# EAGLE design TeensyBreakout (EAGLE 9.5.2)

## Sheet 1 of 2
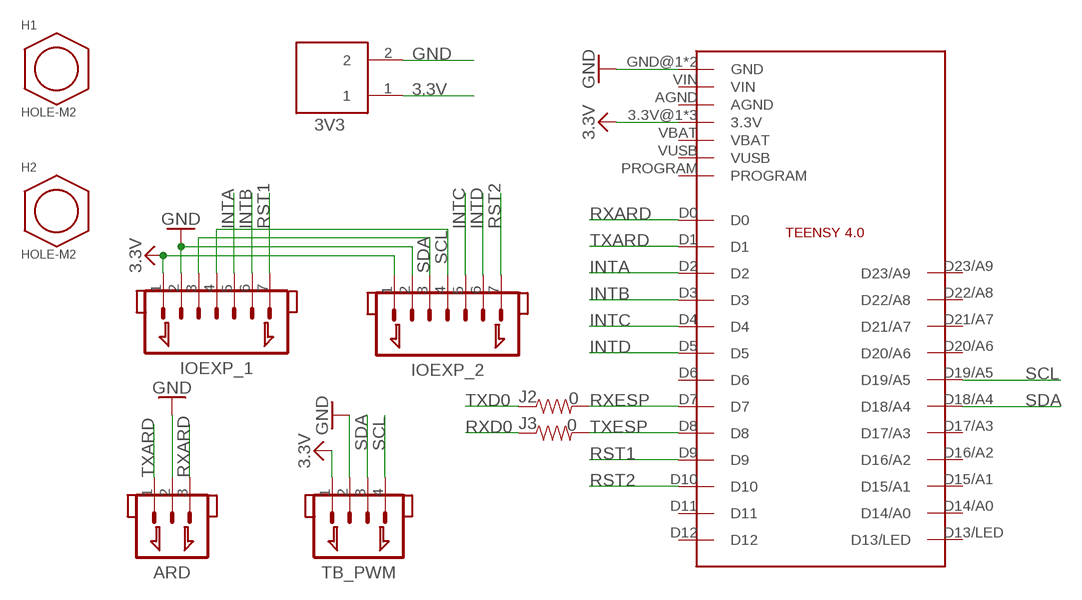
[diagram p0: schematic, sheet 1]

### Parts
3V3  TERMINAL  [ED555/2DS]
ARD  JST_1.25_3P  [JST1.25_3P]
H1  HOLE-M2  [M2]
H2  HOLE-M2  [M2]
IOEXP_1  JST_1.25_7P  [JST1.25_7P]
IOEXP_2  JST_1.25_7P  [JST1.25_7P]
J2  0  RESISTOR0603  [0603]
J3  0  RESISTOR0603  [0603]
TB_PWM  JST_1.25_4P  [JST1.25_4P]
U$1  TEENSY4.0  [TEENSY4.0]

### Nets
3.3V: 3V3.1 IOEXP_1.1 IOEXP_2.1 TB_PWM.1 U$1.3.3V@1(3.3V) U$1.3.3V@2(3.3V) U$1.ON/OFF(3.3V) ; supply symbol labelled SUPPLY_3.3V ; also sheet 2
GND: 3V3.2 ARD.2 IOEXP_1.2 IOEXP_2.2 TB_PWM.2 U$1.GND@1(GND) U$1.GND@2(GND) ; supply symbol labelled SUPPLY_GND ; also sheet 2
INTA: IOEXP_1.5 U$1.D2
INTB: IOEXP_1.6 U$1.D3
INTC: IOEXP_2.5 U$1.D4
INTD: IOEXP_2.6 U$1.D5
RST1: IOEXP_1.7 U$1.D9
RST2: IOEXP_2.7 U$1.D10
RXARD: ARD.3 U$1.D0
RXD0: J3.1 ; also sheet 2
RXESP: J2.2 U$1.D7
SCL: IOEXP_1.4 IOEXP_2.4 TB_PWM.4 U$1.D19/A5
SDA: IOEXP_1.3 IOEXP_2.3 TB_PWM.3 U$1.D18/A4
TXARD: ARD.1 U$1.D1
TXD0: J2.1 ; also sheet 2
TXESP: J3.2 U$1.D8
Unconnected: U$1.AGND U$1.D6 U$1.D11 U$1.D12 U$1.D13/LED U$1.D14/A0 U$1.D15/A1 U$1.D16/A2 U$1.D17/A3 U$1.D20/A6 U$1.D21/A7 U$1.D22/A8 U$1.D23/A9 U$1.PROGRAM U$1.VBAT U$1.VIN U$1.VUSB

## Sheet 2 of 2
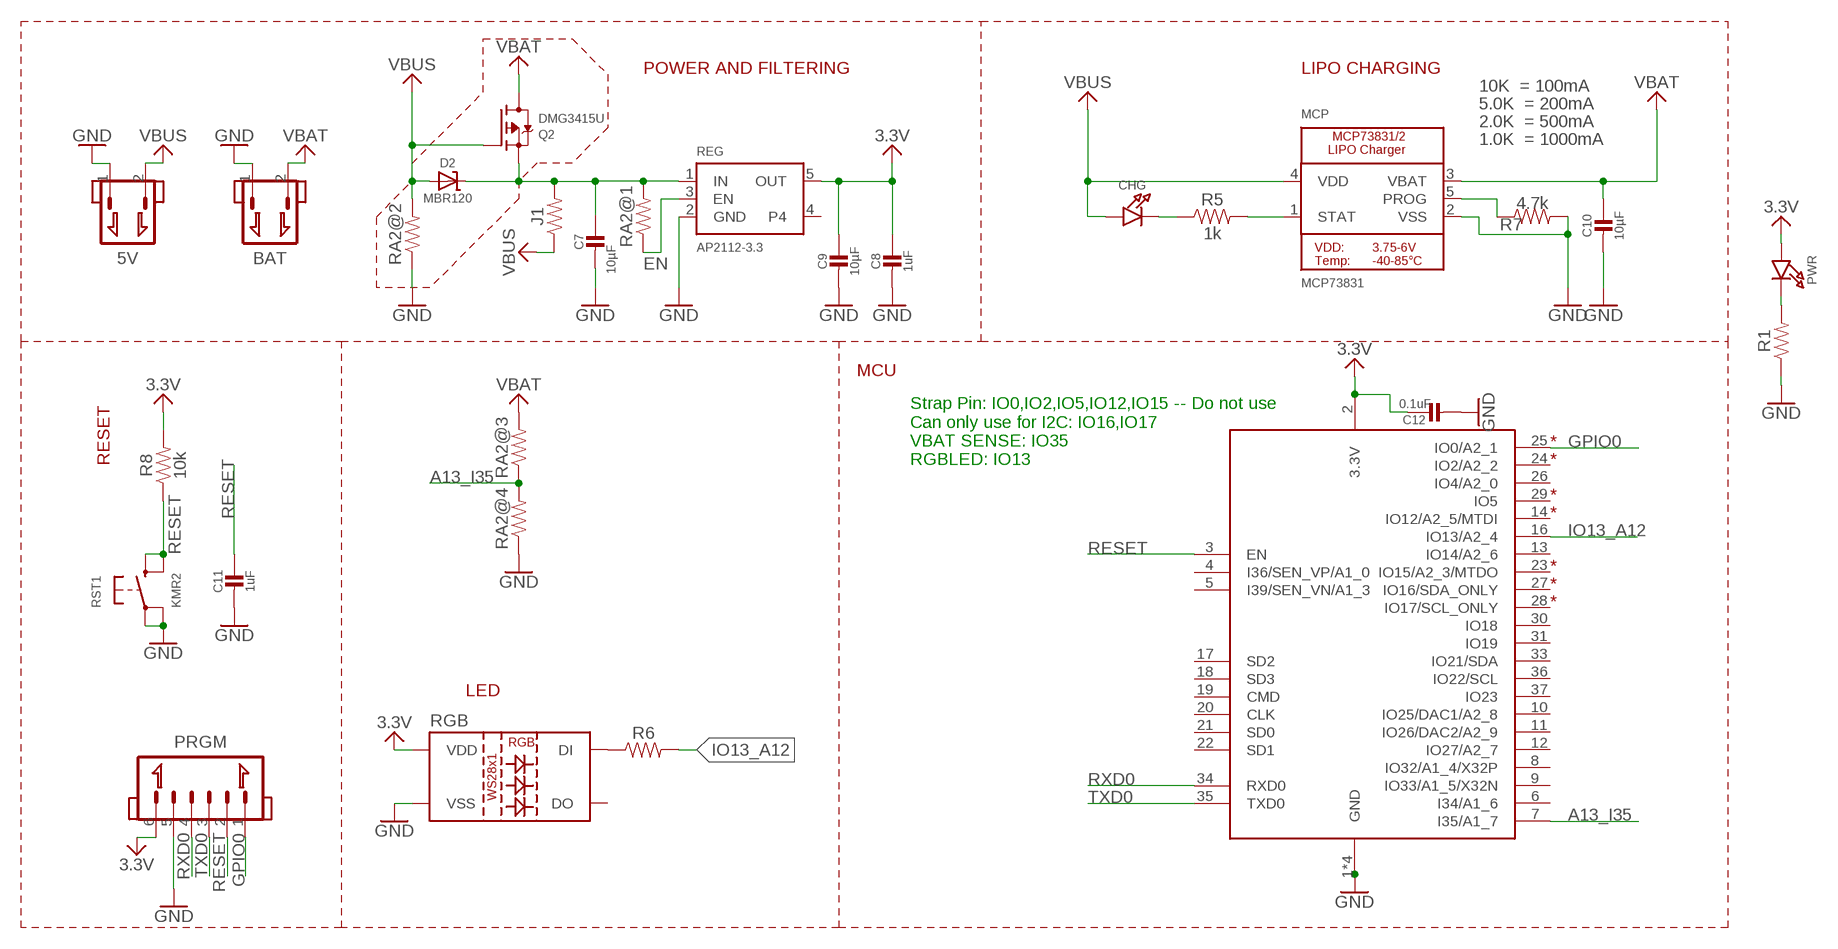
[diagram p1: schematic, sheet 2]

### Parts
5V  JST_PH_2.0_2P  [JST_PH_2.0_2P]
BAT  JSTPH  JST_PH_2.0_2P  [JST_PH_2.0_2P]
C7  10µF  CAP_CERAMIC_0805  [0805]
C8  1uF  CAP_CERAMIC_0603  [0603]
C9  10µF  CAP_CERAMIC_0603  [0603]
C10  10µF  CAP_CERAMIC_0805  [0805]
C11  1uF  CAP_CERAMIC_0603  [0603]
C12  0.1uF  CAP_CERAMIC_0603  [0603]
CHG  LED0603  [CHIPLED_0603]
D2  MBR120  DIODE-SCHOTTKYSOD-123  [SOD-123]
J1  RESISTOR0603  [0603]
MCP  MCP73831  MCP73831/2  [MICROBUILDER_SOT23-5]
PRGM  JST_1.25_6P  [JST1.25_6P]
PWR  LED0603  [CHIPLED_0603]
Q2  DMG3415U  MOSFET-PWIDE  [SOT23-WIDE]
R1  RESISTOR0603  [0603]
R5  1k  RESISTOR0603  [0603]
R6  RESISTOR0603  [0603]
R7  4.7k  RESISTOR0603  [0603]
R8  10k  RESISTOR0603  [0603]
RA2  RESISTOR_ARRAY_1206_SEPARATE_REVERSE  [RESCAF80P320X160X60-8N]
REG  AP2112-3.3  VREG_SOT23-5  [MICROBUILDER_SOT23-5]
RGB  LED_WS2812  [LED-TRICOLOR-5050-IC]
RST1  KMR2  SWITCH_TACT_SMT4.6X2.8  [BTN_KMR2_4.6X2.8]
X1  ESP32_WROOM32  [WROOM32]

### Nets
3.3V: C8.1 C9.1 C12.1 PRGM.6 PWR.A R8.2 REG.5(OUT) RGB.VDD X1.2(3.3V) ; supply symbol labelled SUPPLY_3.3V ; also sheet 1
A13_I35: RA2.4 RA2.6 X1.7(I35/A1_7)
EN: RA2.8 REG.3(EN)
GND: 5V.1 BAT.1 C7.2 C8.2 C9.2 C10.2 C11.2 C12.2 MCP.2(VSS) PRGM.5 R1.1 R7.2 RA2.5 RA2.7 REG.2(GND) RGB.VSS RST1.A'(P1) RST1.A(P) X1.1(GND) X1.15(GND) X1.38(GND) X1.P$1(GND) ; supply symbol labelled SUPPLY_GND ; also sheet 1
GPIO0: PRGM.1 X1.25(IO0/A2_1)
IO13_A12: R6.2 X1.16(IO13/A2_4)
N$1: PWR.C R1.2
N$5: CHG.C R5.1
N$6: MCP.1(STAT) R5.2
N$8: MCP.5(PROG) R7.1
N$9: C7.1 D2.C J1.2 Q2.2(S) RA2.1 REG.1(IN)
N$10: R6.1 RGB.DIN(DI)
RESET: C11.1 PRGM.2 R8.1 RST1.B'(S1) RST1.B(S) X1.3(EN)
RXD0: PRGM.4 X1.34(RXD0) ; also sheet 1
TXD0: PRGM.3 X1.35(TXD0) ; also sheet 1
VBAT: BAT.2 C10.1 MCP.3(VBAT) Q2.3(D) RA2.3 ; supply symbol labelled SUPPLY_VBAT
VBUS: 5V.2 CHG.A D2.A J1.1 MCP.4(VDD) Q2.1(G) RA2.2 ; supply symbol labelled SUPPLY_VBUS
Unconnected: REG.4 RGB.DOUT(DO) X1.4(I36/SEN_VP/A1_0) X1.5(I39/SEN_VN/A1_3) X1.6(I34/A1_6) X1.8(IO32/A1_4/X32P) X1.9(IO33/A1_5/X32N) X1.10(IO25/DAC1/A2_8) X1.11(IO26/DAC2/A2_9) X1.12(IO27/A2_7) X1.13(IO14/A2_6) X1.14(IO12/A2_5/MTDI) X1.17(SD2) X1.18(SD3) X1.19(CMD) X1.20(CLK) X1.21(SD0) X1.22(SD1) X1.23(IO15/A2_3/MTDO) X1.24(IO2/A2_2) X1.26(IO4/A2_0) X1.27(IO16/SDA_ONLY) X1.28(IO17/SCL_ONLY) X1.29(IO5) X1.30(IO18) X1.31(IO19) X1.33(IO21/SDA) X1.36(IO22/SCL) X1.37(IO23)

### Notes on the sheet
- POWER AND FILTERING | LIPO CHARGING
- 10K  = 100mA
- 5.0K  = 200mA
- 2.0K  = 500mA
- 1.0K  = 1000mA
- MCU
- RESET
- Strap Pin: IO0,IO2,IO5,IO12,IO15 -- Do not use
  Can only use for I2C: IO16,IO17
  VBAT SENSE: IO35
  RGBLED: IO13
- LED

## Library data of the parts
3V3 = Scott-Connectors:TERMINAL: 2-Pin Terminal Block 3.5mm pitch 6A
5V BAT = Scott-Connectors:JST_PH_2.0_2P: JST 2-Pin Right-Angle Connector PH-Series - 4UConnector: 17311 SH-Series - 4UConnector: 07278
ARD = Scott-Connectors:JST_1.25_3P
C7-C12 = Scott-Electrical:CAP_CERAMIC
CHG PWR = Scott-Electrical:LED: LED 0603 - 0603 Surface Mount Package 2mA: Green LED - Low Power (3.9mcd, 2ma, 1.7Vf) - Digikey: 475-2709-2-ND Orange LED - Low Power (9.8mcd, 2ma, 1.8Vf) - Digikey: 475-1194-2-ND Red LED - Low Power (5mcd, 2ma, 1.8Vf) - Digikey: 475-1195-2-ND Yellow LED - Low Power (7mcd, 2ma, 1.8Vf) - Digikey: 475-1196-2-ND 5mA: Blue LED - Low Power (17mcd, 5ma, 2.9Vf) - Digikey: LNJ937W8CRACT-ND 0805 - 0805 Surface Mount Package 2mA: Red LED (8.8mcd, 2mA, 1.8Vf, Clear) - Low Power [Digikey: 475-2510-1-ND] Green LED (5mcd, 2mA, 1.8Vf, Clear) - Low Power [Digikey: 475-2730-1-ND] Yellow LED (11.3mcd, 2mA, 1.8Vf, Clear) - Low Power [Digikey: 475-2555-1-ND] 20mA: Red LED (104mcd, 20mA, Diffused) - LS R976 [Digikey: 475-1278-6-ND] Red LED (12mcd, 20mA, 2.0Vf, Clear) - APT2012EC [Digikey: 754-1128-1-ND] Green LED (15mcd, 20mA, 2.2Vf, Clear) - APT2012GC [Digikey: 754-1131-1-ND] Orange LED (160mcd, 20mA, 2.1Vf, Clear) - APT2012SECK [Digikey: 754-1130-1-ND] 1206 - 1206 Surface Mount Package Green LED (26mcd, 20mA, Diffused) - LG N971 [Digikey: 475-1407-6-ND] Red LED (15mcd, 20mA, Diffused) - LH N974 [Digikey: 475-1416-6-ND] Cree - Cree High-Power Surface Mount LEDs XPEBWT-L1-0000-00D50 - White 111lm 350mA 2.9Vf 6200K 110° XTEAWT-00-0000-00000LEE3 - White 114lm 350mA 2.85Vf 5000K 115° Everlight - Everlight 45-21 Series Surface Mount LEDs 45-21/QK2C-B2832AC2CB2/2T - Warm White 2000mcd 20mA 3.25Vf 3050K 120° 45-21/LK2C-B38452C4CB2/2T - Nuetral White 2000mcd 20mA 3.25Vf 4150K 120° 45-21/LK2C-B50634C6CB2/2T - Cold White 2200mcd 20mA 3.25Vf 5650K 120° PLCC2 Reverse Mount LS T77K-J1L2-1-0-2-R18-Z - Red 11.25mcd 2mA 1.8Vf 630nm 120° LO T77K-L1M2-24-Z - Orange 19.6mcd 2mA 1.8Vf 606nm 120° LY T77K-K2M1-26-Z - Yellow 15.7mcd 2mA 1.8Vf 587nm 120°
D2 = Scott-Electrical:DIODE-SCHOTTKY
H1 H2 = Scott-Mechanical:HOLE
IOEXP_1 IOEXP_2 = Scott-Connectors:JST_1.25_7P
J1-J3 R1 R5-R8 = Scott-Electrical:RESISTOR: Generic Resistor Package
MCP = Scott-ICs:MCP73831/2: MCP73831/2 LIPO Charger VDD: 3.75 - 6V Temp -40 - 85°C Programmable Charge Rate: 15-500mA NOTE: STAT is a tri-state logic output on the MCP73831 and an open-drain output on the MCP73832. SOT23-5 with 4.2V output and tri-state logic on STAT = MCP73831T-2ACI/OT
PRGM = Scott-Connectors:JST_1.25_6P
Q2 = Scott-Electrical:MOSFET-P: P-Channel Mosfet LEGEND VDS: Voltage Drain-Source ID: Drain Current RDS(ON): Drain-Source On-State Resistance VGS(TH): Gate-Source Threshold Voltage CISS: Drain-Source Input Capacitance SOT-23 Name VDS ID RDS(ON) VGS(TH) CISS Order Number IRLML5103 30V 760mA 600 mOhm -- 75pF @ 25V Digikey: IRLML5103PBFCT-ND IRLML6401 12V 4.3A 50 mOhm 950mV @ 250µA 830pF @ 10V Digikey: IRLML6401PBFTR-ND NTR0202PL 20V 400mA 800 mOhm 2.3V @ 250uA 70pF @ 5V Digikey: NTR0202PLT1GOSTR-ND NTR4101PT1G 20V 1.8A 85 mOhm 1.2V @ 250uA 675pF @ 10V Digikey: NTR4101PT1GOSCT-ND DMP2004K 20V 600mA 900 mOhm 1V @ 250uA 175pF @ 16V Digikey: DMP2004KDICT-ND PMV65XP 20V 3.9A 76 mOhm 950mV @ 1mA 725pF @ 20V Digikey: 568-2358-2-ND TO-252 Name VDS ID RDS(ON) VGS(TH) CISS Order Number AOD417 30V 25A 34 mOhm 3V @ 250µA 920pF @ 15V Digikey: 785-1106-2-ND PowerPak Name VDS ID RDS(ON) VGS(TH) CISS Order Number AON7401 30V 12A 14 mOhm 3V @ 250µA 2600pF @ 15V Digikey: 785-1302-1-ND
RA2 = Scott-Electrical:RESISTOR_ARRAY_1206_SEPARATE
REG = Scott-ICs:VREG_SOT23-5: SOT23-5 Fixed Voltage Regulators Part Current Out V Out V In V Dropout θJA (°C/W) TJ (°C) Digikey Part No. ADP121 150mA 3.3V 3.4-5.5V 0.09V @ 150mA -- -- ADP121-AUJZ33R7CT-ND ADP121 150mA 3.0V 3.1-5.5V 0.09V @ 150mA -- -- ADP121-AUJZ30R7CT-ND ADP122 300mA 3.3V 3.4-5.5V 0.085V @ 300mA -- -- ADP122AUJZ-3.3-R7CT-ND ADP1712 300mA 3.3V 3.5-5.5V 0.17V @ 300mA -- -- ADP1712AUJZ-3.3-R7TR-ND AP7311 (Low Cost) 150mA 3.3V 3.5-6V 0.15V @ 150mA -- -- AP7311-33WG-7DICT-ND LD39015M18R 150mA 1.8V 1.9V-5.5V 0.08V @ 100mA -- -- 497-6977-1-ND LP2985A-33DBVR 150mA 3.3V 3.3-16V 0.28V @ 150mA 206 150 296-18479-1-ND MCP1824T-3302E/OT 300mA 3.3V 3.5V-6V 0.2V @ 300mA -- -- MCP1824T-3302E/OTCT-ND MIC5205-2.5YM5 TR 150mA 2.5V 2.7-16V 0.165V @ 150mA -- -- 576-1257-2-ND MIC5205-3.0YM5 TR 150mA 3.0V 3.2V-16V 0.165V @ 150mA -- -- 576-1258-2-ND MIC5205-3.3YM5 TR 150mA 3.3V 3.5V-16V 0.165V @ 150mA -- -- 576-1259-2-ND TPS780330220 150mA 3.3V+2.2V 3.6-5.5V 250mV Max -- -- 296-23332-1-ND TDA3663/N1,135 100mA 3.3V 3.5-45V 0.18V @ 50mA -- -- 568-5343-1-ND Max operating temp can be calculated using θJA, TJ (max junction temperature), and power in watts. Set the "Maximum Ambient Temperature" until it reaches TJ ("Max Junction Temperature"), which is the absolute limit for safe use of the regulator: Heat Sink Temperature Calculator <http://www.daycounter.com/Calculators/Heat-Sink-Temperature-Calculator.phtml> For example, With 12V source into a 3.3V LP2985 and a 30mA load, we are dissipating (12V-3.3V) * 0.03A = 0.261W. With a θJA of 206 °C/W, a TJ of 150°C, and 261mW we can safely use the chip without a heat sink up to 75°C (=147.1°C Junction Temperature).
RGB = Scott-ICs:LED_WS2812
RST1 = Scott-Switches:SWITCH_TACT_SMT: SMT Tact Switches 6x6mm - Digikey: P12940SCT-ND KMR2 (4.6x2.8mm) - Digikey: 401-1426-1-ND EVQ-PQHB55 - Light Touch, 160GF (4.5x4.5mm) - Digikey: P8090SCT-ND KMT0 - KMT021 NGJ LHS (etc.) IP68/Waterproof - Digikey: CKN10289CT-ND
TB_PWM = Scott-Connectors:JST_1.25_4P
U$1 = Scott-MCU:TEENSY4.0
X1 = Scott-MCU:ESP32_WROOM32

## Board
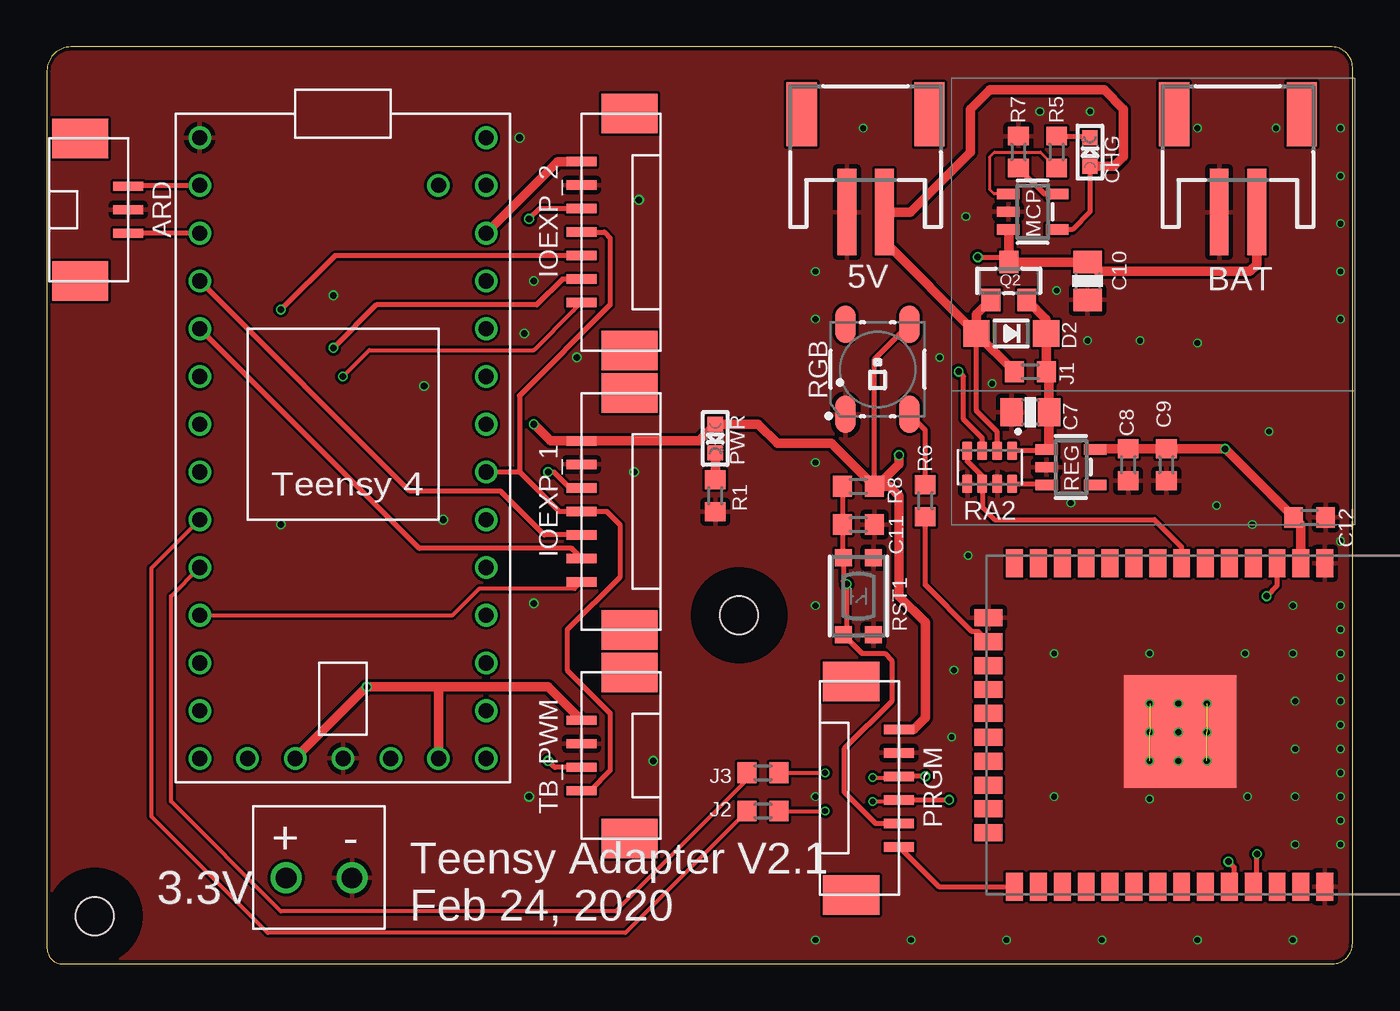
[diagram p2: board, top side]
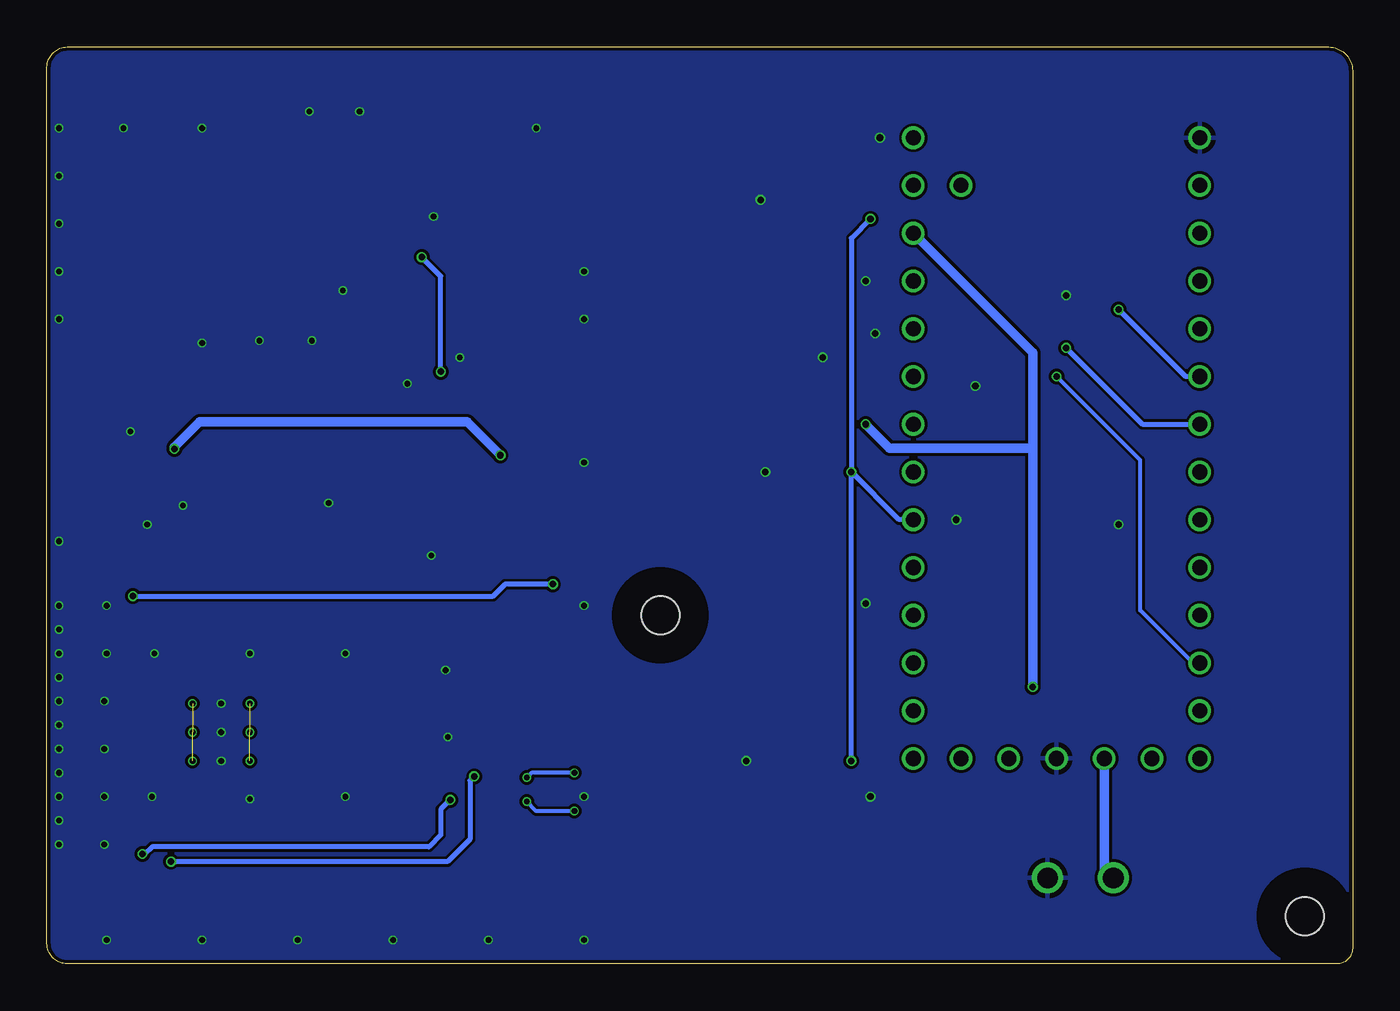
[diagram p3: board, bottom side, seen from below]

Size 69.47 x 48.77 mm. Coordinates in mm from the lower left corner, seen from the top.
Outline: 0,47.5 0,0.82 arc90 0.82,0 68.39,0 arc90 69.47,1.08 69.47,47.69 arc90 68.39,48.77 1.27,48.77 arc90 0,47.5
Copper layers (1*16): Top 0.035559375mm / dielectric 1.6mm / Bottom 0.035559375mm
Design rules "jlcpcb2layer": minimum track width 5mil, minimum drill 12mil, track to track 5mil, track to pad 5mil, pad to pad 5mil, via to via 5mil, smd to smd 5mil, copper to edge 8mil, drill to drill 6mil, minimum pad ring 5mil, minimum via ring 3mil, stop-mask expansion 2.5mil, vias tented up to drill 20mil, thermal gap 10mil

### Footprints (pad centres in the part's own frame; a part is rotated, then mirrored left to right if it is on the bottom)
ED555/2DS = drill 1.1: 1 -1.75,0; 2 1.75,0
JST_PH_2.0_2P = smd 1 x 4.6: 1 -1,-3.7; 2 1,-3.7 | smd 1.6 x 3.4: NC1 -3.4,1.5; NC2 3.4,1.5
JST1.25_3P = smd 0.5 x 1.6: 1 0,0; 2 1.25,0; 3 2.5,0 | smd 2.1 x 3: 4 -2.55,2.55; 5 5.05,2.55
0805 = smd 1.2 x 1.5: 1 -1,0; 2 1,0
0603 = smd 1 x 1.1: 1 -0.85,0; 2 0.85,0
CHIPLED_0603 = smd 0.8 x 0.8: A 0,-0.75; C 0,0.75
SOD-123 = smd 1.4 x 1.4: A 1.85,0; C -1.85,0
M2 = hole 2.032: 0,0
JST1.25_7P = smd 0.5 x 1.6: 1 0,0; 2 1.25,0; 3 2.5,0; 4 3.75,0; 5 5,0; 6 6.25,0; 7 7.5,0 | smd 2.1 x 3: 8 -2.55,2.55; 9 10.05,2.55
MICROBUILDER_SOT23-5 = smd 0.55 x 1.2: 1 -0.95,-1.3; 2 0,-1.3; 3 0.95,-1.3; 4 0.95,1.3; 5 -0.95,1.3
JST1.25_6P = smd 0.5 x 1.6: 1 0,0; 2 1.25,0; 3 2.5,0; 4 3.75,0; 5 5,0; 6 6.25,0 | smd 2.1 x 3: 7 -2.55,2.55; 8 8.8,2.55
SOT23-WIDE = smd 1 x 1.2: 1 -0.95,-1; 2 0.95,-1; 3 0,1
RESCAF80P320X160X60-8N = smd 0.97 x 0.53: 1 -0.875,1.2; 2 -0.875,0.4; 3 -0.875,-0.4; 4 -0.875,-1.2; 5 0.875,-1.2; 6 0.875,-0.4; 7 0.875,0.4; 8 0.875,1.2
LED-TRICOLOR-5050-IC = smd 2 x 1.1: DIN -2.4,-1.7; DOUT 2.4,1.7; VDD 2.4,-1.7; VSS -2.4,1.7
BTN_KMR2_4.6X2.8 = smd 0.9 x 0.9: A 2.05,0.8; A' -2.05,0.8; B 2.05,-0.8; B' -2.05,-0.8
JST1.25_4P = smd 0.5 x 1.6: 1 0,0; 2 1.25,0; 3 2.5,0; 4 3.75,0 | smd 2.1 x 3: 5 -2.55,2.55; 6 6.3,2.55
TEENSY4.0 = drill 0.8: 3.3V@1 7.62,10.16; 3.3V@2 -2.54,-17.78; AGND 7.62,12.7; D0 -7.62,12.7; D1 -7.62,10.16; D2 -7.62,7.62; D3 -7.62,5.08; D4 -7.62,2.54; D5 -7.62,0; D6 -7.62,-2.54; D7 -7.62,-5.08; D8 -7.62,-7.62; D9 -7.62,-10.16; D10 -7.62,-12.7; D11 -7.62,-15.24; D12 -7.62,-17.78; D13/LED 7.62,-17.78; D14/A0 7.62,-15.24; D15/A1 7.62,-12.7; D16/A2 7.62,-10.16; D17/A3 7.62,-7.62; D18/A4 7.62,-5.08; D19/A5 7.62,-2.54; D20/A6 7.62,0; D21/A7 7.62,2.54; D22/A8 7.62,5.08; D23/A9 7.62,7.62; GND@1 -7.62,15.24; GND@2 0,-17.78; ON/OFF 5.08,-17.78; PROGRAM 2.54,-17.78; VBAT -5.08,-17.78; VIN 7.62,15.24; VUSB 5.08,12.7
WROOM32 = smd 1.5 x 0.9: 1 -8.6,5; 2 -8.6,3.73; 3 -8.6,2.46; 4 -8.6,1.19; 5 -8.6,-0.08; 6 -8.6,-1.35; 7 -8.6,-2.62; 8 -8.6,-3.89; 9 -8.6,-5.16; 10 -8.6,-6.43; 11 -8.6,-7.7; 12 -8.6,-8.97; 13 -8.6,-10.24; 14 -8.6,-11.51; 25 8.6,-11.51; 26 8.6,-10.24; 27 8.6,-8.97; 28 8.6,-7.7; 29 8.6,-6.43; 30 8.6,-5.16; 31 8.6,-3.89; 32 8.6,-2.62; 33 8.6,-1.35; 34 8.6,-0.08; 35 8.6,1.19; 36 8.6,2.46; 37 8.6,3.73; 38 8.6,5 | smd 0.9 x 1.5: 15 -5.7,-12.9; 16 -4.43,-12.9; 17 -3.16,-12.9; 18 -1.89,-12.9; 19 -0.62,-12.9; 20 0.65,-12.9; 21 1.92,-12.9; 22 3.19,-12.9; 23 4.46,-12.9; 24 5.73,-12.9 | smd 6 x 6: P$1 0.34,-2.7

### Placement (x,y rotation side)
3V3  14.48,4.57 0 top
5V  43.56,43.69 0 top
ARD  4.32,38.86 90 top
BAT  63.37,43.69 0 top
C7  52.32,29.34 180 top
C8  57.53,26.54 270 top
C9  59.56,26.54 270 top
C10  55.37,36.32 270 top
C11  43.18,23.37 0 top
C12  67.18,23.75 0 top
CHG  55.5,43.18 0 top
D2  51.31,33.53 180 top
H1  2.54,2.54 0 top
H2  36.83,18.54 0 top
IOEXP_1  28.45,27.81 270 top
IOEXP_2  28.45,42.67 270 top
J1  52.32,31.5 0 top
J2  38.1,8.13 180 top
J3  38.1,10.16 180 top
MCP  52.45,40.01 270 top
PRGM  45.34,6.22 90 top
PWR  35.56,27.94 180 top
Q2  51.18,36.32 0 top
R1  35.56,24.89 90 top
R5  53.72,43.18 270 top
R6  46.74,24.64 270 top
R7  51.69,43.18 90 top
R8  43.18,25.4 0 top
RA2  50.16,26.42 270 top
REG  54.48,26.42 270 top
RGB  44.2,31.62 90 top
RST1  43.18,19.56 270 top
TB_PWM  28.45,12.95 270 top
U$1  15.75,28.7 0 top
X1  62.99,12.7 270 top

### Tracks (layer width: path | path; a pad name or v marks a point on that pad's centre or on a via)
3.3V  (via drill 0.35)
  Top 0.254: RGB.VDD 44.03,32.16 R8.2 44.16,25.4
  Top 0.508: U$1.3.3V@2 v17.02,14.73 | TB_PWM.1 26.67,14.73 v17.02,14.73 | U$1.3.3V@1 27.18,42.67 IOEXP_2.1 | v25.91,28.7 26.8,27.81 IOEXP_1.1 34.68,27.81 PWR.A 37.85,28.7 38.86,27.69 41.74,27.69 R8.2 44.83,25.4 45.34,24.89 45.34,19.56 46.74,18.16 46.74,13.08 46.13,12.47 PRGM.6 | v17.02,14.73 20.83,14.73 U$1.ON/OFF | REG.5 55.81,27.39 C8.1 C9.1 v62.69,27.39 C12.1 66.72,23.36 X1.2 | 44.16,25.4 45.34,26.58 v45.34,27.05
  Bottom 0.254: 62.69,27.48 v62.69,27.39
  Bottom 0.508: U$1.3.3V@1 17.02,32.51 17.02,27.43 | 17.02,27.43 v17.02,14.73 | v25.91,28.7 24.64,27.43 17.02,27.43 | v45.34,27.05 47.12,28.83 61.34,28.83 62.69,27.48 | U$1.3.3V@2 13.21,5.05 3V3.1
A13_I35
  Top 0.254: RA2.4 48.97,26.73 49.77,25.93 RA2.6 49.77,24.28 50.42,23.62 58.93,23.62 60.37,22.18 X1.7
EN
  Top 0.254: RA2.8 53.11,25.54 REG.3
GND  (via drill 0.3, 0.35)
  other vias: 28.19,32.26 25.4,33.53 25.91,19.18 25.65,8.89 32.26,10.79 31.24,26.16 31.5,40.64 25.15,43.94 25.91,36.32 15.24,35.56 20.07,30.73 21.08,23.62 12.45,23.37 60.2,12.32 60.2,13.84 60.2,10.79 68.83,19.05 68.83,17.78 68.83,15.24 68.83,16.51 68.83,13.97 68.83,12.7 68.83,11.43 68.83,10.16 68.83,8.89 68.83,7.62 68.83,6.35 65.4,44.45 61.21,44.45 61.21,33.02 65.02,28.32 64.13,23.37 62.23,24.38 66.29,19.05 66.29,16.51 66.42,13.97 66.42,11.43 66.42,8.89 66.42,6.35 63.88,8.89 58.67,8.76 53.59,8.89 53.59,16.51 58.67,16.51 63.75,16.51 48.13,12.07 48.26,15.62 49.02,21.72 48.9,39.75 43.43,44.45 40.89,36.83 40.89,34.29 40.89,26.67 40.89,19.05 40.89,8.89 40.89,1.27 45.97,1.27 51.05,1.27 56.13,1.27 61.21,1.27 66.29,1.27 54.48,24.51 47.5,32.26 52.83,45.34 55.5,45.34 53.72,35.81 50.29,30.86 58.17,33.15 55.37,33.15 68.83,22.48 68.83,34.29 68.83,36.83 68.83,39.37 68.83,41.91 68.83,44.45
  pour Top (isolate 0.152, rank 6): -0.76,50.29 -0.76,-1.9 70.23,-1.9 70.23,50.29
  pour Bottom (isolate 0.152, rank 6): -0.76,50.29 70.23,50.29 70.23,-2.03 -0.76,-2.03
  pour Top (isolate 0.152, no thermals): 65.02,17.27 55.75,17.27 55.75,7.49 65.02,7.49
GND3  (via drill 0.3)  (2 unrouted)
  other vias: 61.72,12.32 61.72,13.84 61.72,10.79
GND4  (via drill 0.3)  (2 unrouted)
  other vias: 58.67,12.32 58.67,13.84 58.67,10.79
GPIO0
  Top 0.254: PRGM.1 47.46,4.1 X1.25
INTA
  Top 0.254: IOEXP_1.5 26.46,22.81 24.13,25.15 19.3,25.15 U$1.D2
INTB
  Top 0.254: IOEXP_1.6 27.91,22.1 19.81,22.1 U$1.D3
INTC  (via drill 0.35)
  Top 0.254: IOEXP_2.5 15.32,37.67 v12.45,34.8
  Bottom 0.254: v12.45,34.8 8.89,31.24 U$1.D4
INTD  (via drill 0.35)
  Top 0.254: IOEXP_2.6 27.43,36.42 26.06,35.05 17.53,35.05 v15.24,32.77
  Bottom 0.254: v15.24,32.77 11.18,28.7 U$1.D5
IO13_A12
  Top 0.254: X1.16 49.55,17.67 49.23,17.67 46.74,20.16 R6.2
N$1
  Top 0.508: PWR.C R1.2
N$5
  Top 0.254: R5.1 55.4,44.03 CHG.C
N$6
  Top 0.152: MCP.1 50.39,40.96 50.16,41.18 50.16,42.93 50.42,43.18 52.87,43.18 R5.2
N$8
  Top 0.254: R7.1 53.06,40.96 MCP.5
N$9
  Top 0.254: REG.1 53.11,27.29 RA2.1
  Top 0.508: Q2.2 53.16,34.3 D2.C 53.17,33.51 J1.2 53.32,31.35 C7.1 53.32,27.51 REG.1
N$10
  Top 0.254: R6.1 46.74,28.38 RGB.DIN
RESET  (via drill 0.35)
  Top 0.254: R8.1 C11.1 42.33,21.66 RST1.B' 42.38,20.36 v42.55,20.19 42.55,17.67 RST1.B 43.38,16.51 44.58,16.51 44.96,16.13 44.96,13.97 42.42,11.43 42.42,9.14 44.09,7.47 PRGM.2 | X1.3 65.45,20.11 v64.9,19.56
  Bottom 0.254: v42.55,20.19 45.09,20.19 45.72,19.56 v64.9,19.56
RST1
  Top 0.203: U$1.D9 21.59,18.54 22.99,19.94 28.07,19.94 IOEXP_1.7
RST2  (via drill 0.35)
  Top 0.203: v15.75,31.24 17.14,32.64 25.91,32.64 28,34.73 IOEXP_2.7
  Bottom 0.203: U$1.D10 8.51,16 11.3,18.8 11.3,26.8 v15.75,31.24
RXARD
  Top 0.254: ARD.3 4.36,41.4 U$1.D0
RXD0  (via drill 0.3, 0.35)
  Top 0.203: J3.1 v41.4,10.16 | v43.94,9.91 45.27,9.91 PRGM.4
  Top 0.254: v46.74,9.97 PRGM.4 | v62.87,5.44 63.17,5.14 63.17,4.35 X1.34
  Bottom 0.203: v41.4,10.16 43.69,10.16 v43.94,9.91
  Bottom 0.254: v46.74,9.97 46.97,9.74 46.97,6.63 48.16,5.44 v62.87,5.44
RXESP
  Top 0.203: J2.2 30.77,1.65 11.75,1.65 5.56,7.84 5.56,21.05 U$1.D7
SCL
  Top 0.254: U$1.D19/A5 25.15,26.16 | 25.15,26.16 27.25,24.06 IOEXP_1.4 29.79,24.06 30.48,23.37 30.48,20.57 27.69,17.78 27.69,15.62 29.97,13.34 29.97,10.29 28.89,9.2 TB_PWM.4 | IOEXP_2.4 29.66,38.92 29.97,38.61 29.97,35.05 25.15,30.23 25.15,26.16
SDA  (via drill 0.35)
  Top 0.254: v26.67,26.16 26.96,26.16 27.81,25.31 IOEXP_1.3 | IOEXP_2.3 26.2,40.17 v25.65,39.62 | TB_PWM.3 27.01,10.45 v26.67,10.79
  Bottom 0.254: U$1.D18/A4 24.13,23.62 v26.67,26.16 | v25.65,39.62 26.67,38.61 v26.67,26.16 | v26.67,10.79 v26.67,26.16
TXARD
  Top 0.254: U$1.D1 ARD.1
TXD0  (via drill 0.3, 0.35)
  Top 0.203: J2.1 v41.4,8.13 | v43.94,8.64 45.25,8.64 PRGM.3
  Top 0.254: PRGM.3 v48.01,8.72 | X1.35 64.39,4.31 v64.39,5.84
  Bottom 0.203: v41.4,8.13 43.43,8.13 v43.94,8.64
  Bottom 0.254: v48.01,8.72 48.51,8.21 48.51,6.86 49.15,6.22 63.88,6.22 64.26,5.84 v64.39,5.84
TXESP
  Top 0.203: J3.2 37.25,9.78 30.27,2.79 12.45,2.79 6.6,8.64 6.6,19.56 U$1.D8
VBAT  (via drill 0.35)
  Top 0.254: RA2.3 49.77,27.96 48.77,28.96 48.77,31.24 v48.51,31.5 | v49.53,37.59 50.91,37.59 Q2.3
  Top 0.508: MCP.3 51.18,39.02 Q2.3 51.21,37.35 51.24,37.32 C10.1 55.4,37.35 55.93,36.83 64.01,36.83 64.37,37.2 BAT.2
  Bottom 0.254: v48.51,31.5 48.51,36.58 v49.53,37.59
VBUS
  Top 0.254: CHG.A 55.5,40.01 54.55,39.05 MCP.4 | RA2.2 50.56,28.3 49.46,29.41 D2.A
  Top 0.508: Q2.1 49.46,34.55 D2.A | D2.A 44.56,38.42 5V.2 45.96,39.99 49.15,43.18 49.15,45.47 50.16,46.48 56.26,46.48 57.28,45.47 57.28,42.93 56.78,42.43 CHG.A | D2.A 51.47,31.51 J1.1

### Text on the board
tPlace: + | - | 3.3V | Teensy Adapter V2.1 / Feb 24, 2020
tDocu: LiPo Charging | 3V3 / Reg/Filter